# Altium schematic sheet NodeSTM32.SchDoc
size A0
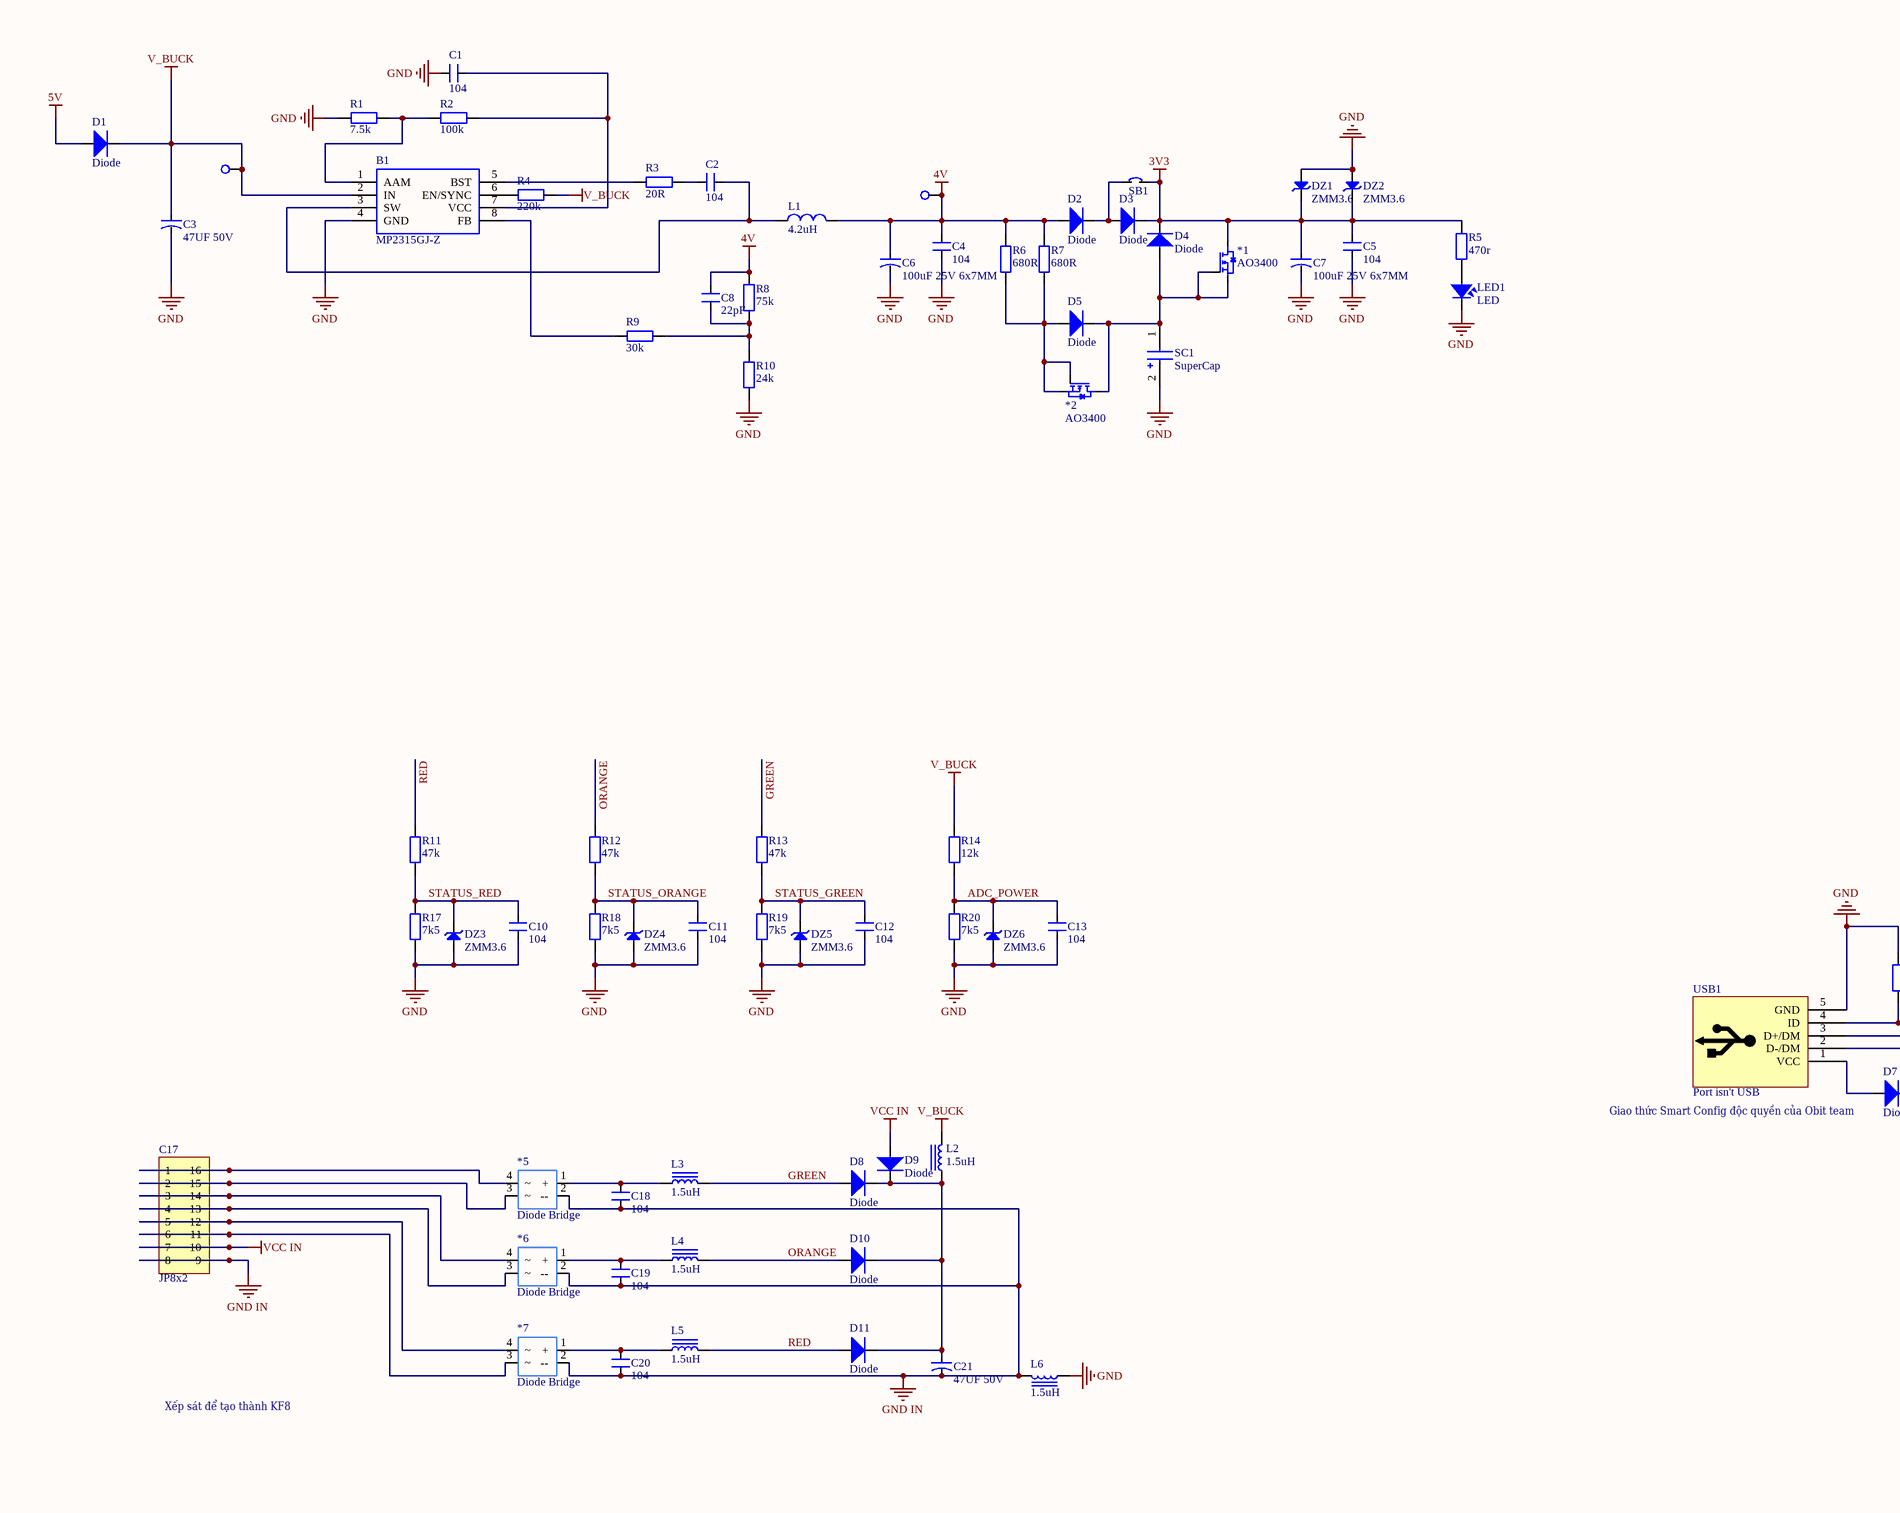
[diagram p0: NodeSTM32.SchDoc, left]
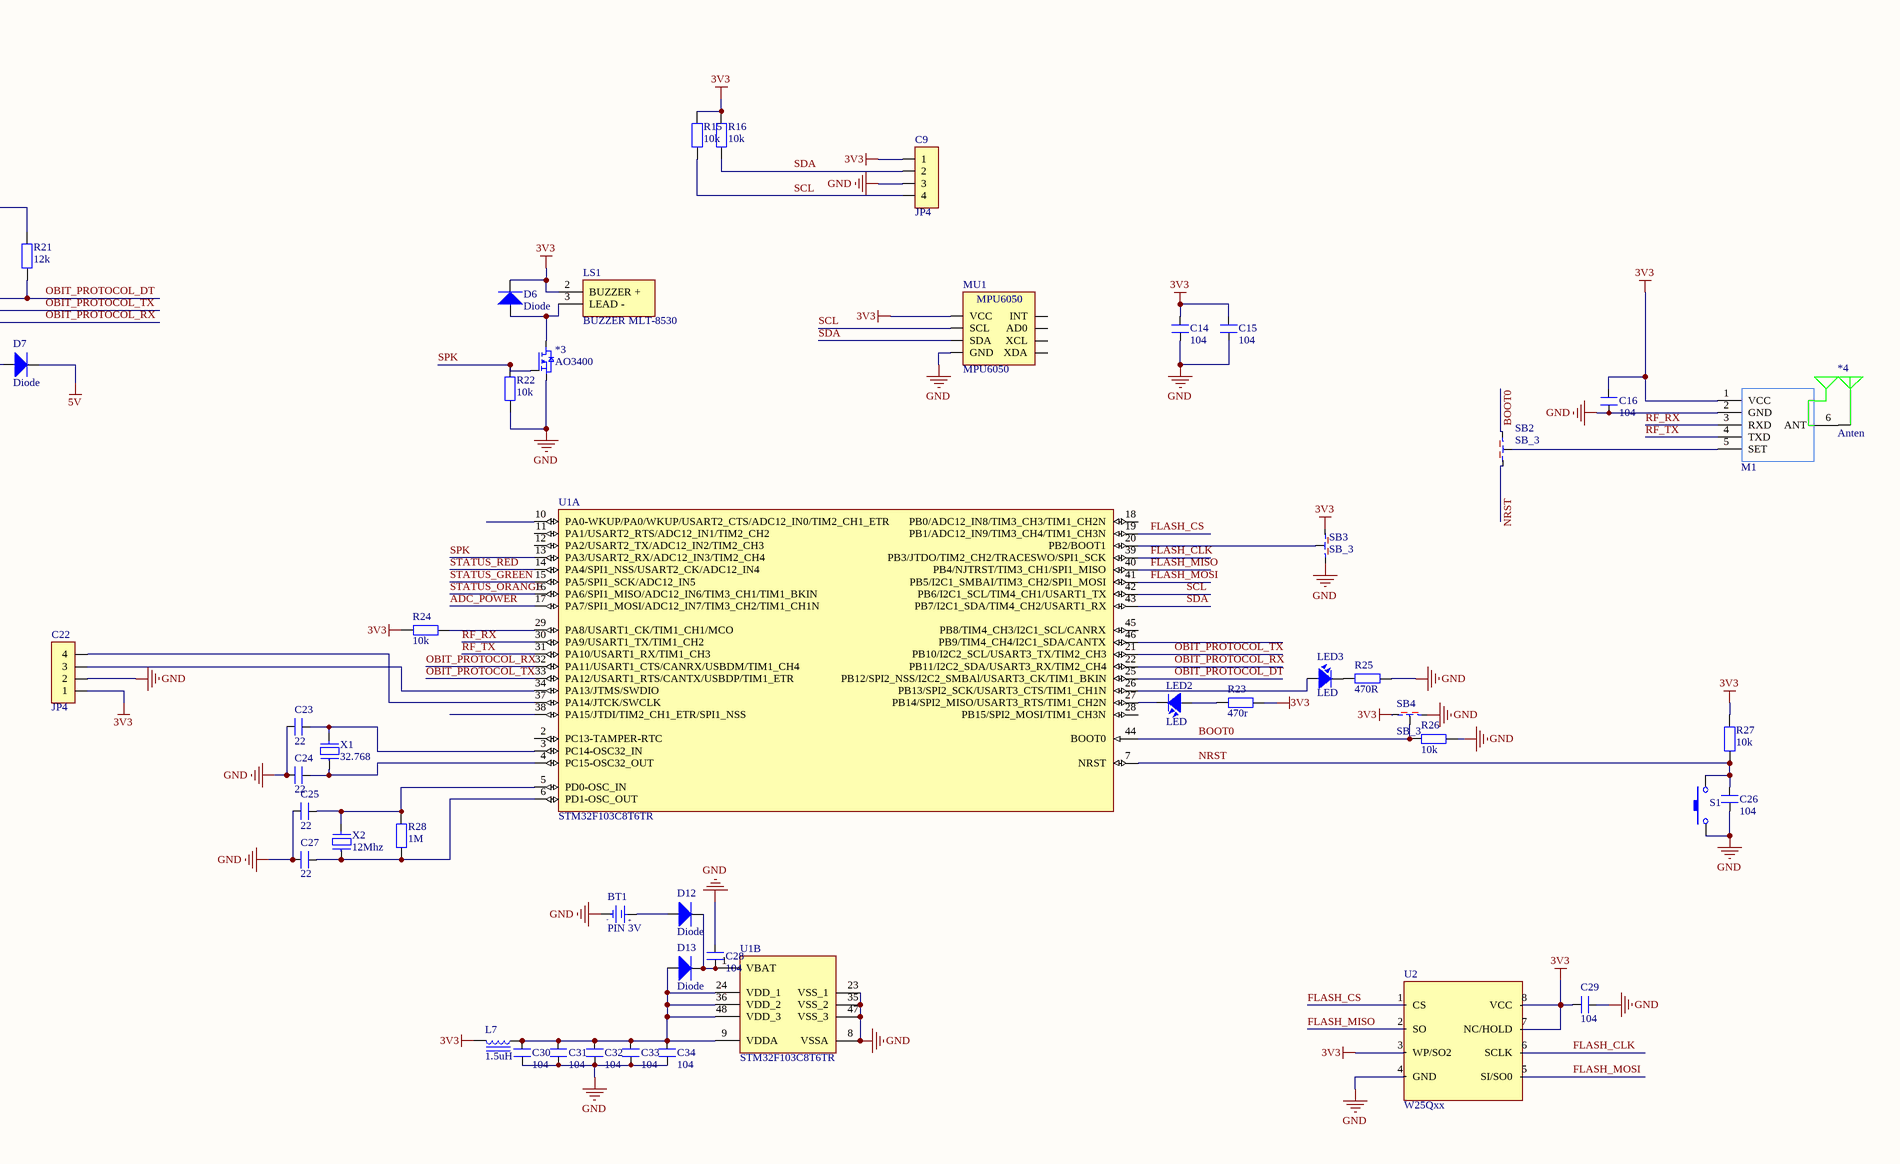
[diagram p1: NodeSTM32.SchDoc, right]

## Parts
*1  AO3400  [SOT23-123]
*2  AO3400  [SOT23-123]
*3  AO3400  [SOT23-123]
*4  Anten  [LOXO_433_NGANG]
*5  Diode Bridge  [Diode Bridge 1A]
*6  Diode Bridge  [Diode Bridge 1A]
*7  Diode Bridge  [Diode Bridge 1A]
*TP1  TP  [TP]  (value not drawn)
*TP2  TP  [TP]  (value not drawn)
B1  MP2315GJ-Z  [SOT65P280X100-8N]
BT1  PIN 3V  [PIN CR1220-SMD]
C1  104  [SM-0805]
C2  104  [SM-0805]
C3  47UF 50V  [CAP-ALU-SMD-6.3x7.7x2.2]
C4  104  [SM-0805]
C5  104  [SM-0805]
C6  100uF 25V 6x7MM  [CAP-ALU-SMD-6.3x7.7x2.2]
C7  100uF 25V 6x7MM  [CAP-ALU-SMD-6.3x7.7x2.2]
C8  22pF  [SM-0805]
C9  JP4  [JP4-C1T]
C10  104  [SM-0805]
C11  104  [SM-0805]
C12  104  [SM-0805]
C13  104  [SM-0805]
C14  104  [SM-0805]
C15  104  [SM-0805]
C16  104  [SM-0805]
C17  JP8x2  [JP8-D2T]
C18  104  [SM-0805]
C19  104  [SM-0805]
C20  104  [SM-0805]
C21  47UF 50V  [CAP-ALU-SMD-6.3x7.7x2.2]
C22  JP4  [JP4-C1T]
C23  22  [SM-0805]
C24  22  [SM-0805]
C25  22  [SM-0805]
C26  104  [SM-0805]
C27  22  [SM-0805]
C28  104  [SM-0805]
C29  104  [SM-0805]
C30  104  [SM-0805]
C31  104  [SM-0805]
C32  104  [SM-0805]
C33  104  [SM-0805]
C34  104  [SM-0805]
D1  Diode  [SOD123]
D2  Diode  [DIO-SMD-123]
D3  Diode  [DIO-SMD-123]
D4  Diode  [DIO-SMD-123]
D5  Diode  [DIO-SMD-123]
D6  Diode  [DIO-SMD-123]
D7  Diode  [DIO-SMD-123]
D8  Diode  [DIO-SMD-123]
D9  Diode  [DIO-SMD-123]
D10  Diode  [DIO-SMD-123]
D11  Diode  [DIO-SMD-123]
D12  Diode  [SOD123]
D13  Diode  [SOD123]
DZ1  ZMM3.6  [SOD123]
DZ2  ZMM3.6  [DIO-SMD-123]
DZ3  ZMM3.6  [SOD123]
DZ4  ZMM3.6  [SOD123]
DZ5  ZMM3.6  [SOD123]
DZ6  ZMM3.6  [SOD123]
L1  4.2uH  [IND 4532-2P]
L2  1.5uH  [FER 0805/2012]
L3  1.5uH  [FER 0805/2012]
L4  1.5uH  [FER 0805/2012]
L5  1.5uH  [FER 0805/2012]
L6  1.5uH  [FER 0805/2012]
L7  1.5uH  [FER 0805/2012]
LED1  LED  [SM-LED-0805-Blue]
LED2  LED  [SM-LED-0805-Blue]
LED3  LED  [SM-LED-0805-Blue]
LS1  BUZZER MLT-8530  [MLT8530]
M1  CC1101  [CC1101 UART HC11]  (value not drawn)
MU1  MPU6050  [MPU6050]
R1  7.5k  [RES-SMD-0805]
R2  100k  [RES-SMD-0805]
R3  20R  [RES-SMD-0805]
R4  220k  [RES-SMD-0805]
R5  470r  [RES-SMD-0805]
R6  680R  [RES-SMD-0805]
R7  680R  [RES-SMD-0805]
R8  75k  [RES-SMD-0805]
R9  30k  [RES-SMD-0805]
R10  24k  [RES-SMD-0805]
R11  47k  [RES-SMD-0805]
R12  47k  [RES-SMD-0805]
R13  47k  [RES-SMD-0805]
R14  12k  [RES-SMD-0805]
R15  10k  [RES-SMD-0805]
R16  10k  [RES-SMD-0805]
R17  7k5  [RES-SMD-0805]
R18  7k5  [RES-SMD-0805]
R19  7k5  [RES-SMD-0805]
R20  7k5  [RES-SMD-0805]
R21  12k  [RES-SMD-0805]
R22  10k  [RES-SMD-0805]
R23  470r  [RES-SMD-0805]
R24  10k  [RES-SMD-0805]
R25  470R  [RES-SMD-0805]
R26  10k  [RES-SMD-0805]
R27  10k  [RES-SMD-0805]
R28  1M  [RES-SMD-0805]
S1  SW  [BUTTON-SMD 2PIN]  (value not drawn)
SB1  SB  [SB]  (value not drawn)
SB2  SB_3  [SB_3]
SB3  SB_3  [SB_3]
SB4  SB_3  [SB_3]
SC1  SuperCap  [SuperCapacitor]
U1  STM32F103C8T6TR  [STM-LQFP48_N]  (parts A,B of 2)
U2  W25Qxx  [SO-8N]
USB1  Port isn't USB  [USB-M1]
X1  32.768  [XT32k]
X2  12Mhz  [XT2]

## Nets
3V3: *1.2 C5.2 C7.1 C9.1 C14.2 C15.2 C16.2 C22.1 C29.1 D3.2 D4.2 D6.2 DZ1.2(K) DZ2.2(K) L7.2 LS1.2(BUZZER_+) M1.1(VCC) MU1.1(VCC) R5.2 R15.2 R16.2 R23.2 R24.2 R27.2 SB1.2 SB3.1 SB4.1 U2.3(WP/SO2) U2.7(NC/HOLD) U2.8(VCC)
4V: *TP2.1 C4.2 C6.1 C8.2 D2.1 L1.2 R6.1 R7.1 R8.1
5V: D1.1 D7.2
GND: *3.3 B1.4(GND) BT1.2(GND) C1.2 C3.2 C4.1 C5.1 C6.2 C7.2 C9.3 C10.1 C11.1 C12.1 C13.1 C14.1 C15.1 C16.1 C22.2 C23.2 C24.2 C25.2 C26.2 C27.2 C28.1 C29.2 C30.2 C31.2 C32.2 C33.2 C34.2 DZ1.1(A) DZ2.1(A) DZ3.1(A) DZ4.1(A) DZ5.1(A) DZ6.1(A) L6.1 LED1.2 M1.2(GND) MU1.2(GND) R1.2 R10.2 R17.2 R18.2 R19.2 R20.2 R21.1 R22.2 R25.2 R26.1 S1.1 SB3.3 SB4.3 SC1.2(-) U1.8(VSSA) U1.23(VSS_1) U1.35(VSS_2) U1.47(VSS_3) U2.4(GND) USB1.5(GND)
GND IN: *5.2(--) *6.2(--) *7.2(--) C17.8 C17.9 C18.1 C19.1 C20.1 C21.2 L6.2
V_BUCK: *TP1.1 B1.2(IN) C3.1 D1.2 L2.2 R4.1 R14.1
VCC IN: C17.7 C17.10 D9.1
ADC_POWER: C13.2 DZ6.2(K) R14.2 R20.1 U1.17(PA7/SPI1_MOSI/ADC12_IN7/TIM3_CH2/TIM1_CH1N)
BOOT0: R26.2 SB2.3 SB4.2 U1.44(BOOT0)
FLASH_CLK: U1.39(PB3/JTDO/TIM2_CH2/TRACESWO/SPI1_SCK) U2.6(SCLK)
FLASH_CS: U1.19(PB1/ADC12_IN9/TIM3_CH4/TIM1_CH3N) U2.1(CS)
FLASH_MISO: U1.40(PB4/NJTRST/TIM3_CH1/SPI1_MISO) U2.2(SO)
FLASH_MOSI: U1.41(PB5/I2C1_SMBAI/TIM3_CH2/SPI1_MOSI) U2.5(SI/SO0)
GREEN: D8.1 L3.2 R13.1
NRST: C26.1 R27.1 S1.2 SB2.1 U1.7(NRST)
OBIT_PROTOCOL_DT: R21.2 U1.25(PB12/SPI2_NSS/I2C2_SMBAl/USART3_CK/TIM1_BKIN) USB1.4(ID)
OBIT_PROTOCOL_RX: U1.22(PB11/I2C2_SDA/USART3_RX/TIM2_CH4) U1.32(PA11/USART1_CTS/CANRX/USBDM/TIM1_CH4) USB1.2(D-/DM)
OBIT_PROTOCOL_TX: U1.21(PB10/I2C2_SCL/USART3_TX/TIM2_CH3) U1.33(PA12/USART1_RTS/CANTX/USBDP/TIM1_ETR) USB1.3(D+/DM)
ORANGE: D10.1 L4.2 R12.1
RED: D11.1 L5.2 R11.1
RF_RX: M1.3(RXD) U1.30(PA9/USART1_TX/TIM1_CH2)
RF_TX: M1.4(TXD) U1.31(PA10/USART1_RX/TIM1_CH3)
SCL: C9.4 MU1.3(SCL) R15.1 U1.42(PB6/I2C1_SCL/TIM4_CH1/USART1_TX)
SDA: C9.2 MU1.4(SDA) R16.1 U1.43(PB7/I2C1_SDA/TIM4_CH2/USART1_RX)
SPK: *3.1 R22.1 U1.13(PA3/USART2_RX/ADC12_IN3/TIM2_CH4)
STATUS_GREEN: C12.2 DZ5.2(K) R13.2 R19.1 U1.15(PA5/SPI1_SCK/ADC12_IN5)
STATUS_ORANGE: C11.2 DZ4.2(K) R12.2 R18.1 U1.16(PA6/SPI1_MISO/ADC12_IN6/TIM3_CH1/TIM1_BKIN)
STATUS_RED: C10.2 DZ3.2(K) R11.2 R17.1 U1.14(PA4/SPI1_NSS/USART2_CK/ADC12_IN4)
Net*1_1: *1.1 *1.3 *2.2 D4.1 D5.2 SC1.1(+)
Net*2_1: *2.1 *2.3 D5.1 R6.2 R7.2
Net*3_2: *3.2 D6.1 LS1.3(LEAD_-)
Net*4_1: *4.1 M1.6(ANT)
Net*5_1: *5.1(+) C18.2 L3.1
Net*5_3: *5.3 C17.2 C17.15
Net*5_4: *5.4 C17.1 C17.16
Net*6_1: *6.1(+) C19.2 L4.1
Net*6_3: *6.3 C17.4 C17.13
Net*6_4: *6.4 C17.3 C17.14
Net*7_1: *7.1(+) C20.2 L5.1
Net*7_3: *7.3 C17.6 C17.11
Net*7_4: *7.4 C17.5 C17.12
NetB1_1: B1.1(AAM) R1.1 R2.2
NetB1_3: B1.3(SW) C2.1 L1.1
NetB1_5: B1.5(BST) R3.2
NetB1_6: B1.6(EN/SYNC) R4.2
NetB1_7: B1.7(VCC) C1.1 R2.1
NetB1_8: B1.8(FB) R9.1
NetBT1_1: BT1.1(+3V) D12.1
NetC2_2: C2.2 R3.1
NetC8_1: C8.1 R8.2 R9.2 R10.1
NetC21_1: C21.1 D8.2 D9.2 D10.2 D11.2 L2.1
NetC22_3: C22.3 U1.34(PA13/JTMS/SWDIO)
NetC22_4: C22.4 U1.37(PA14/JTCK/SWCLK)
NetC23_1: C23.1 U1.3(PC14-OSC32_IN) X1.2
NetC24_1: C24.1 U1.4(PC15-OSC32_OUT) X1.1
NetC25_1: C25.1 R28.2 U1.5(PD0-OSC_IN) X2.2
NetC27_1: C27.1 R28.1 U1.6(PD1-OSC_OUT) X2.1
NetC28_2: C28.2 D12.2 D13.2 U1.1(VBAT)
NetC30_1: C30.1 C31.1 C32.1 C33.1 C34.1 D13.1 L7.1 U1.9(VDDA) U1.24(VDD_1) U1.36(VDD_2) U1.48(VDD_3)
NetD2_2: D2.2 D3.1 SB1.1
NetD7_1: D7.1 USB1.1(VCC)
NetLED1_1: LED1.1 R5.1
NetLED2_1: LED2.1 R23.1
NetLED2_2: LED2.2 U1.27(PB14/SPI2_MISO/USART3_RTS/TIM1_CH2N)
NetLED3_1: LED3.1 U1.26(PB13/SPI2_SCK/USART3_CTS/TIM1_CH1N)
NetLED3_2: LED3.2 R25.1
NetM1_5: M1.5(SET) SB2.2
NetR24_1: R24.1 U1.29(PA8/USART1_CK/TIM1_CH1/MCO)
NetSB3_2: SB3.2 U1.20(PB2/BOOT1)

Not connected (* = marked no-connect by the designer): MU1 5(XDA) 6(XCL) 7(AD0) 8(INT); U1 2(PC13-TAMPER-RTC) 10(PA0-WKUP/PA0/WKUP/USART2_CTS/ADC12_IN0/TIM2_CH1_ETR) 11(PA1/USART2_RTS/ADC12_IN1/TIM2_CH2) 12(PA2/USART2_TX/ADC12_IN2/TIM2_CH3) 18(PB0/ADC12_IN8/TIM3_CH3/TIM1_CH2N) 28(PB15/SPI2_MOSI/TIM1_CH3N) 38(PA15/JTDI/TIM2_CH1_ETR/SPI1_NSS) 45(PB8/TIM4_CH3/I2C1_SCL/CANRX) 46(PB9/TIM4_CH4/I2C1_SDA/CANTX)

## Notes on the sheet
- (near D7) Giao thức Smart Config độc quyền của Obit team
- Xếp sát để tạo thành KF8
- (in symbol PIN 3V) -; +

## Library data of the parts
B1 = MP2315GJ-Z: Switching Voltage Regulators 3A 24V 500kHz Sync buck; Manufacturer_Name: Monolithic Power Systems (MPS); Geometry.Height: 1mm; Manufacturer_Part_Number: MP2315GJ-Z; RS Part Number: *; RS Price/Stock: *; Arrow Part Number: MP2315GJ-Z; Arrow Price/Stock: *; Datasheet Link: https://componentsearchengine.com/Datasheets/1/MP2315GJ-Z.pdf
BT1 = PIN 3V: Battery 3VDC; Value: PIN 3V
C1 C2 C4 C5 C8 C10-C16 C18-C20 C23-C34 = CM: Cap SMD; Value: 103
C3 C21 = CN-ALU-SMD: Tụ Nhôm 47UF 50V 6.3x5.5MM; Published: 8-Jun-2000; LatestRevisionDate: 17-Jul-2002; LatestRevisionNote: Re-released for DXP Platform.; PackageReference: POLAR0.8; Publisher: Altium Limited
C6 C7 = CN-ALU-SMD: Polarized Capacitor (Axial); Published: 8-Jun-2000; LatestRevisionDate: 17-Jul-2002; LatestRevisionNote: Re-released for DXP Platform.; PackageReference: POLAR0.8; Publisher: Altium Limited
C9 C22 = JP4: WR-PHD 2.54 mm Angled Socket Header; Manufacturer: W¨¹rth Elektronik eiSos GmbH; partNo: 613004143121; ComponentLink1 Description: Manufacturer; ComponentLink2 Description: Datasheet; NoPins: 04; Created Date: 29 March 2013; ComponentLink1URL: http://www.we-online.com; ComponentLink2URL: http://katalog.we-online.de/em/datasheet/6130xx143121.pdf; Created by: Karrer Zheng
C17 = JP8x2: WR-PHD 2.54 mm Dual Socket Header; Manufacturer: W¨¹rth Elektronik eiSos GmbH; partNo: 61301621821; ComponentLink1 Description: Manufacturer; ComponentLink2 Description: Datasheet; NoPins: 16; Created Date: 29 March 2013; ComponentLink1URL: http://www.we-online.com; ComponentLink2URL: http://katalog.we-online.de/em/datasheet/6130xx21821.pdf; Created by: Karrer Zheng
DZ1-DZ6 = DIODE Zener: DIODE GEN PURP 75V 200MA LLDS
L1 = INDUCTOR B
L2-L7 = Inductor: SMT Inductor; Value: 1.5uH
LS1 = BUZZER MLT-8530: Loudspeaker or Buzzer; Manufacturer_Name: Jiangsu Huaneng Elec; Datasheet Link: https://datasheet.lcsc.com/szlcsc/1811182003_Jiangsu-Huaneng-Elec-MLT-8530_C94599.pdf; Height: 3mm; Manufacturer_Part_Number: MLT-8530
M1 = CC1101 UART HC11: OBIT TEAM / CC1101 UART 433MHZ
MU1 = MPU6050: Manufacturer: W¨¹rth Elektronik eiSos GmbH; partNo: 613004143121; ComponentLink1 Description: Manufacturer; ComponentLink2 Description: Datasheet; NoPins: 04; Created Date: 29 March 2013; ComponentLink1URL: http://www.we-online.com; ComponentLink2URL: http://katalog.we-online.de/em/datasheet/6130xx143121.pdf; Created by: Karrer Zheng
R1-R28 = R: Resistor R1/4W
S1 = SW-Button: Switch-Button; Published: 24-Mar-1999; LatestRevisionDate: 17-Jul-2002; LatestRevisionNote: Re-released for DXP Platform.; PackageReference: SPST-2; Publisher: Altium Limited
SC1 = 5.5V 0.22F
U1 = STM32F103C8T6TR: ARM Cortex-M3 32-bit MCU, 64 KB Flash, 20 KB Internal RAM, 37 I/Os, 48-pin LQFP, -40 to 85 degC, Tape and Reel; A/D Converter: 2x12-bit (10 Channel); FLASH Size (Prog) (kB): 64; I/Os (High Current): 37; Internal RAM Size (kB): 20; Operating Frequency(F) (Processor speed) (MHz): 72; Supply Voltage(Vcc) min (V): 2; DatasheetVersion: Rev. 16; PackageVersion: Rev. 6, 06/2013; PackageReference: LQFP48; PackageDescription: 48-Pin Low Profile Quad Flat Package, 7 x 7 mm Body, 0.5 mm Pitch; Supplier 1: Digi-Key; Supplier Part Number 1: STM32F103C8T6TR-ND; Supplier 2: Mouser; Supplier Part Number 2: 511-STM32F103C8T6TR; Core: ARM Cortex-M3; Packing: Tape and Reel; Mounting Technology: Surface Mount; PartNumber: STM32F103C8T6TR; ComponentLink1Description: Manufacturer URL; ComponentLink1URL: http://www.st.com/web/en/home.html; ComponentLink2Description: Datasheet; ComponentLink2URL: http://www.st.com/st-web-ui/static/active/en/resource/technical/document/datasheet/CD00161566.pdf; ComponentLink3Description: Package Specification; ComponentLink3URL: http://www.st.com/st-web-ui/static/active/en/resource/technical/document/datasheet/DM00058181.pdf
USB1 = USB_M
X1 X2 = XT2: Crystal, 32.768 KHz, -40 to 85 degC, 3.2 x 1.5 x 0.9 mm SMD; Value: 4Mhz